# EasyEDA Pro project AD637峰值_运放峰值_AGC_AD8367_万能运放.eprj, schematic Schematic1

## Sheets
1 P1: Board Name: Board1; Create Date: 2025-02-21; Page Name: P1; Project Name: AD637峰值_运放峰值_AGC_AD8367_万能运放; Schematic Name: Schematic1; Update Date: 2025-06-21; Company: 嘉立创EDA; Page Size: A4; Version: V1.0
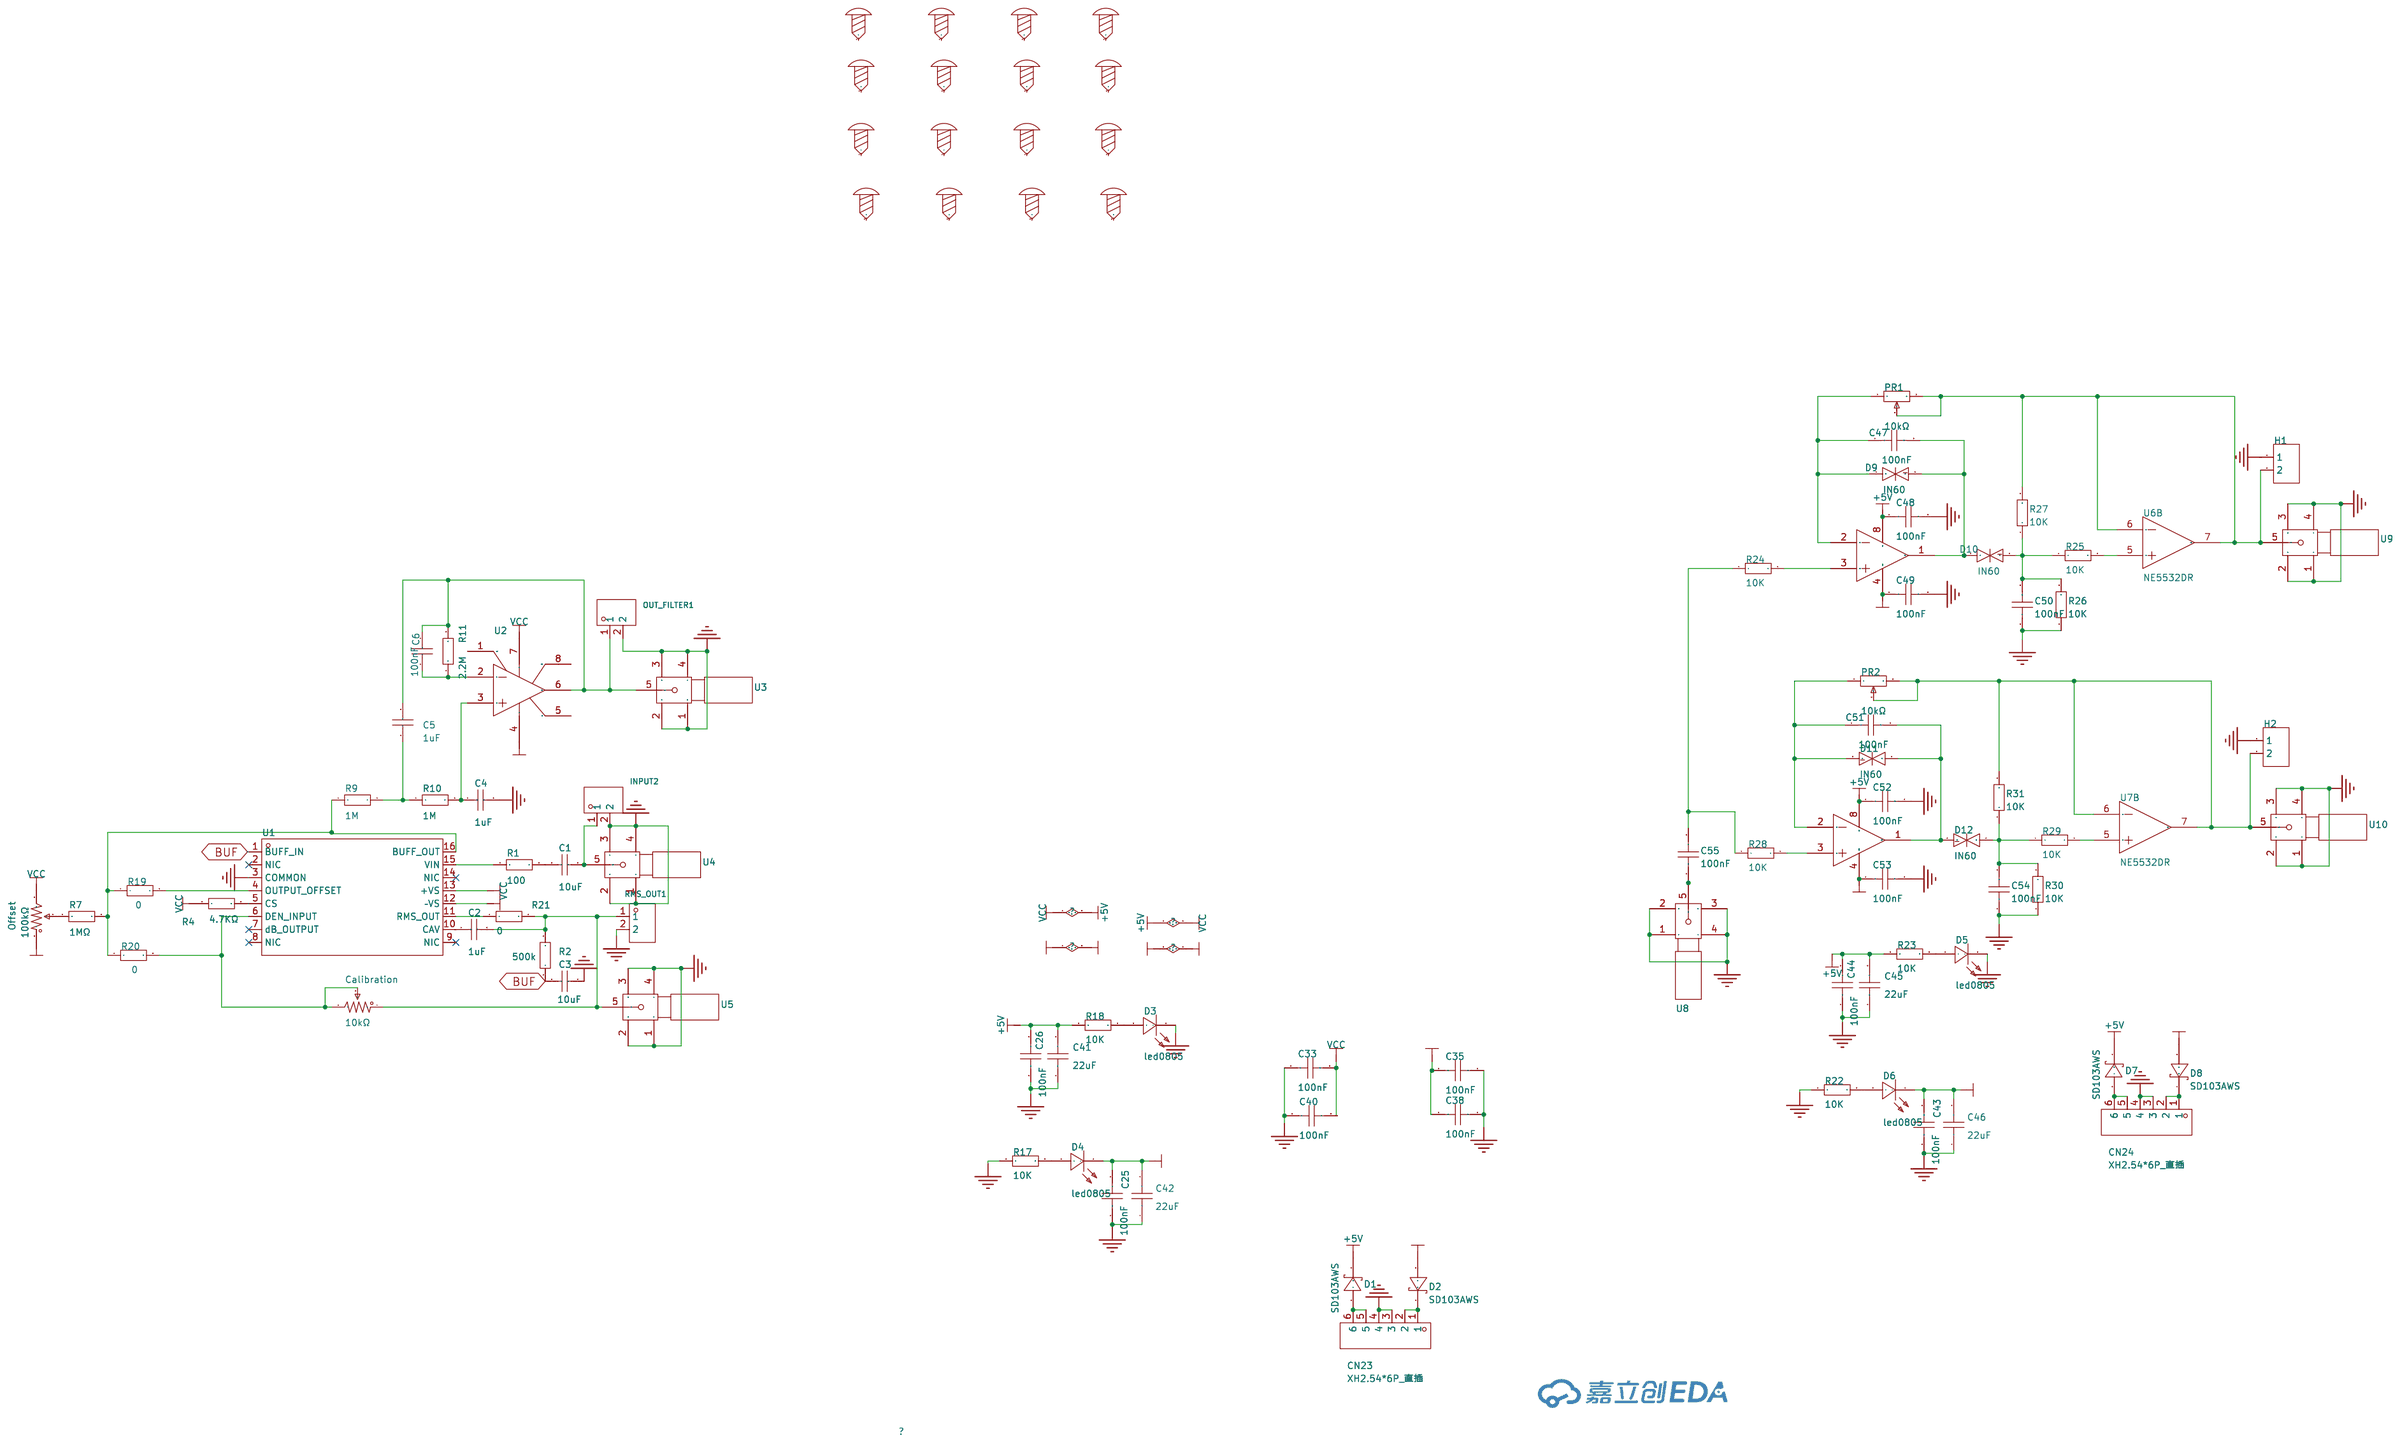
[diagram p0: P1]
2 P2: Create Date: 2025-04-23; Page Name: P2; Update Date: 2025-04-23
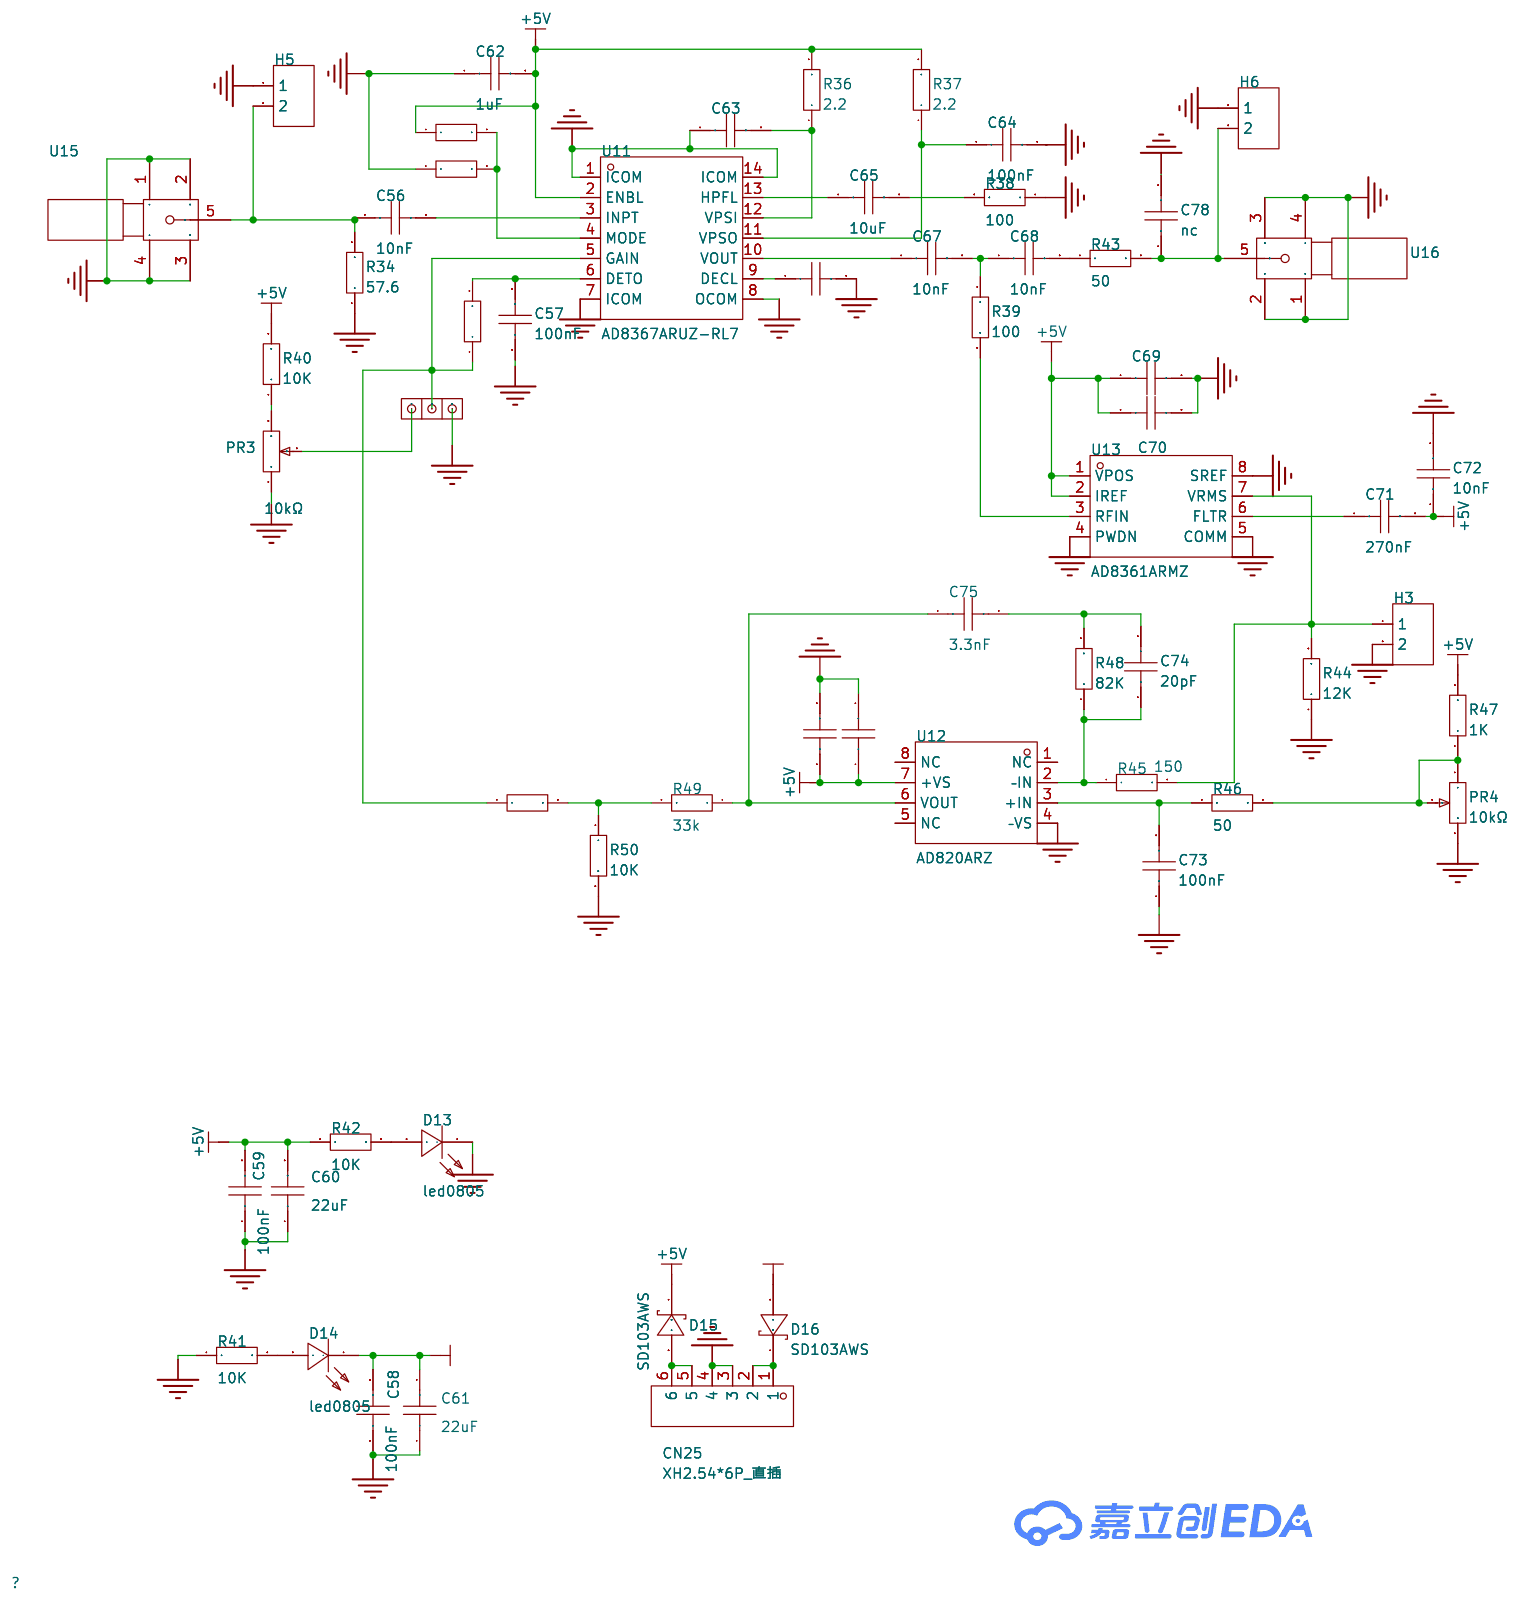
[diagram p1: P2]
3 P3: Create Date: 2025-04-23; Page Name: P3; Update Date: 2025-04-24
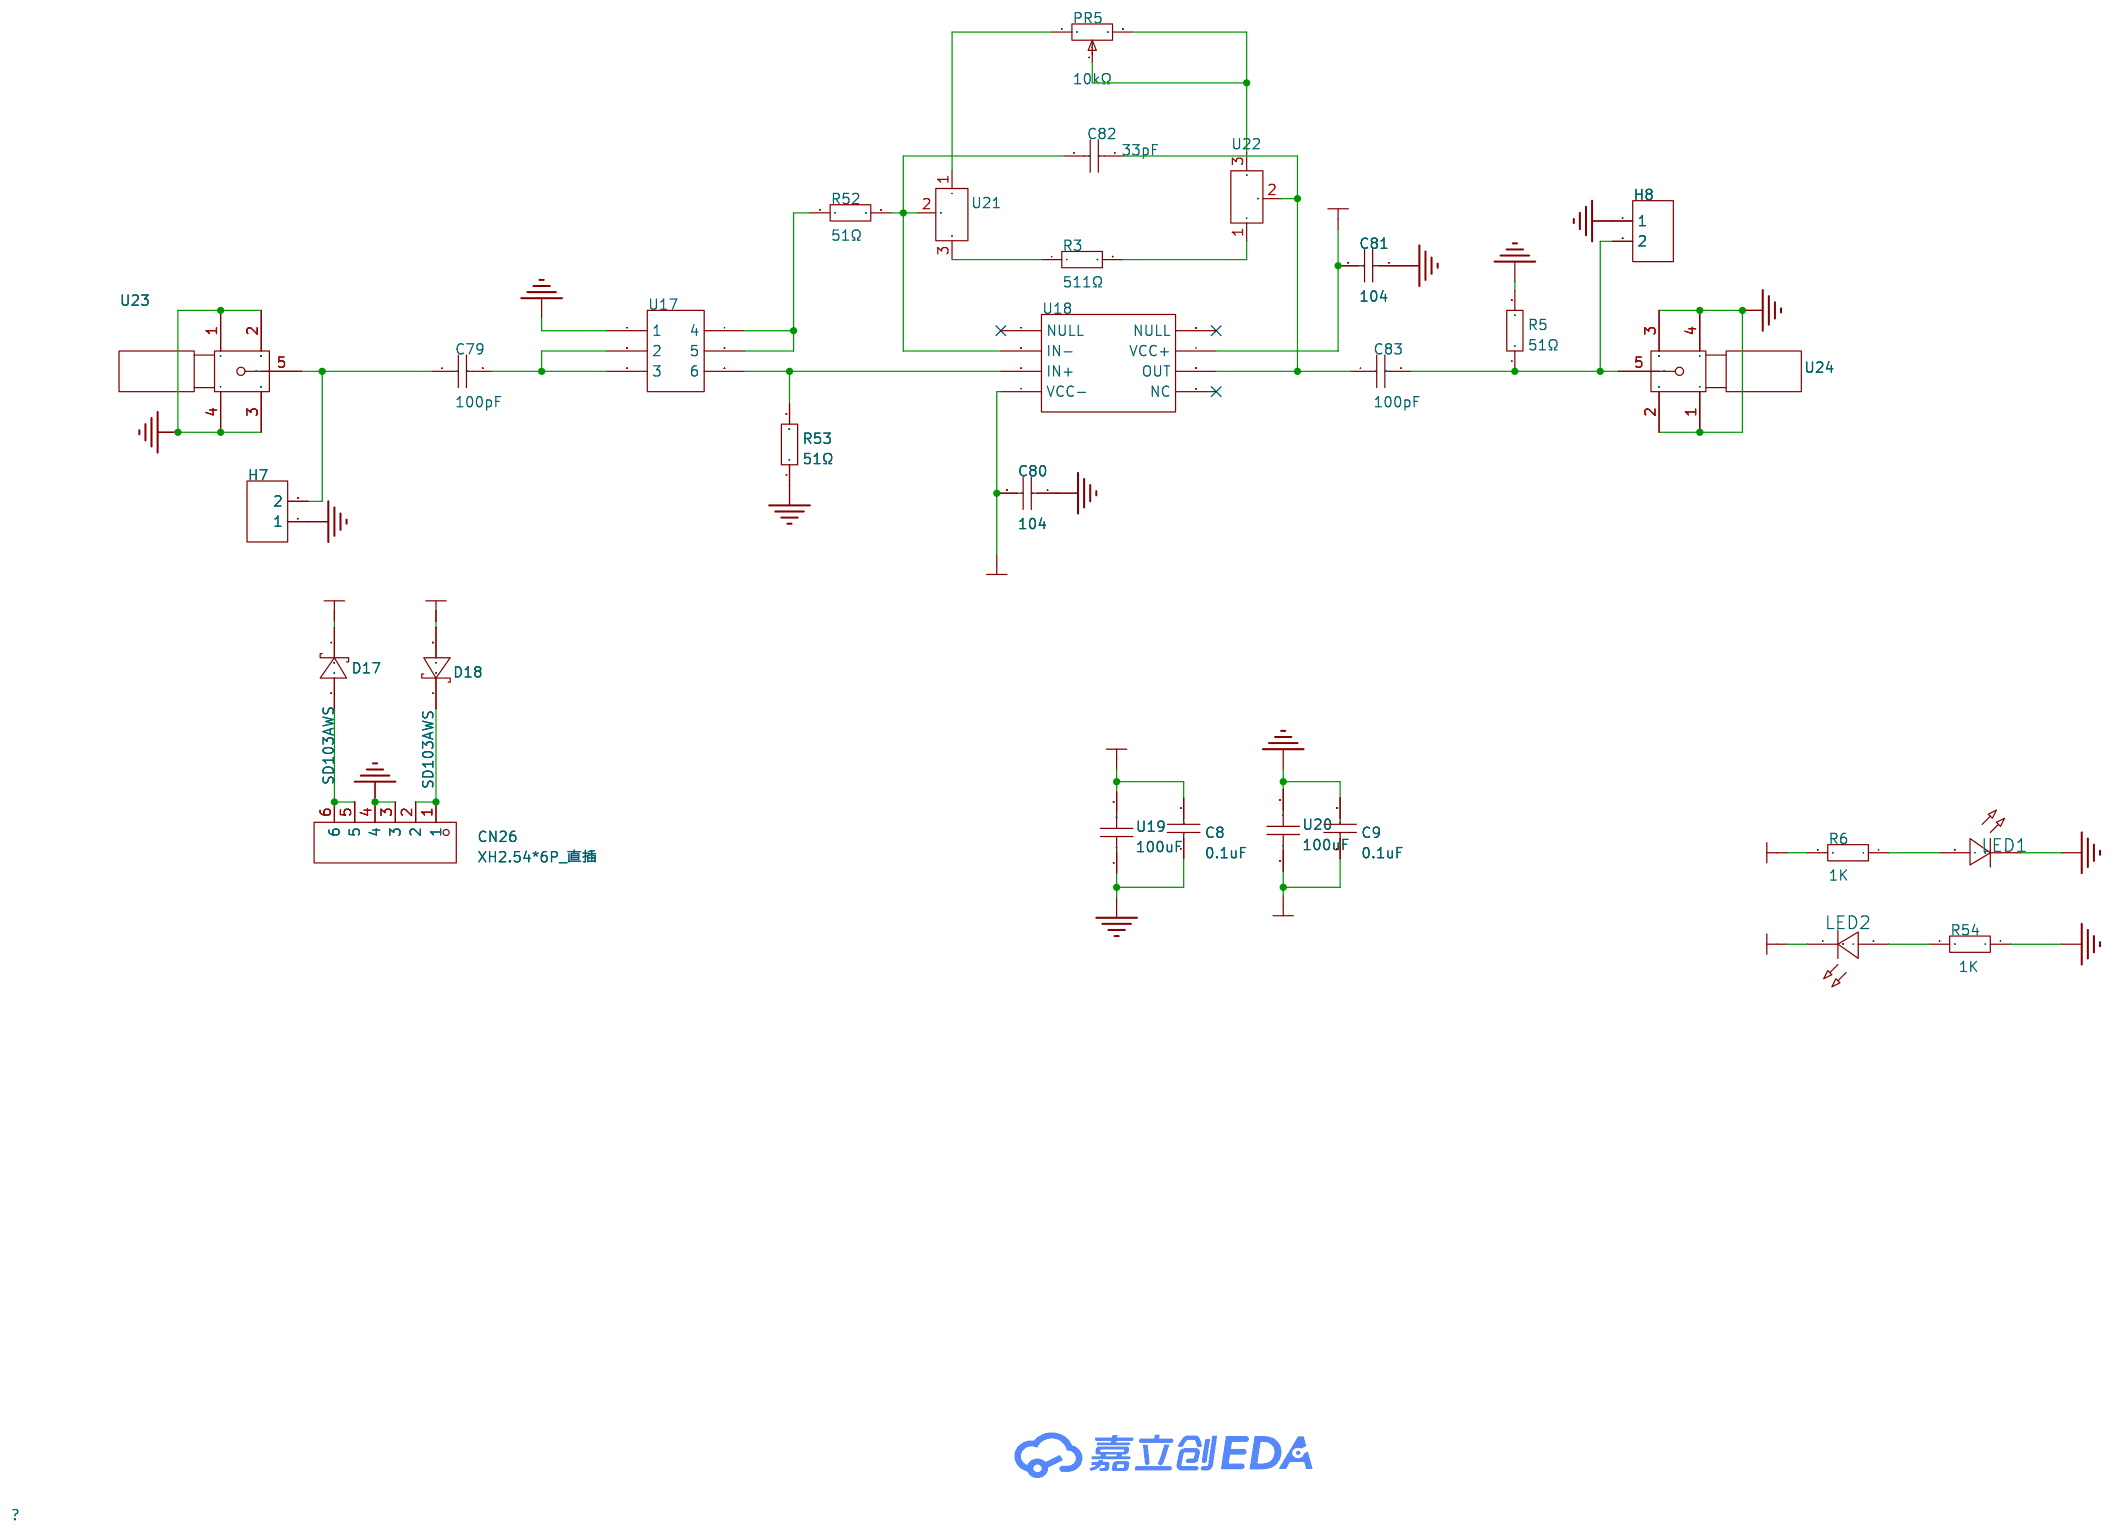
[diagram p2: P3]

## Parts
sheet P1
C1  10uF  [R0805]
C2  1uF  [R0805]
C3  10uF  [R0805]
C4  1uF  [R0805]
C5  1uF  [R0805]
C6  100nF  [R0805]
C25  100nF  [R0805]
C26  100nF  [R0805]
C33  100nF  [R0805]
C35  100nF  [R0805]
C38  100nF  [R0805]
C40  100nF  [R0805]
C41  22uF  [C1210]
C42  22uF  [C1210]
C43  100nF  [R0805]
C44  100nF  [R0805]
C45  22uF  [C1210]
C46  22uF  [C1210]
C47  100nF  [R0805]
C48  100nF  [R0805]
C49  100nF  [R0805]
C50  100nF  [R0805]
C51  100nF  [R0805]
C52  100nF  [R0805]
C53  100nF  [R0805]
C54  100nF  [R0805]
C55  100nF  [R0805]
Calibration  10kΩ  [RES-ADJ-TH_3P-L10.0-W10.0-P2.50-L]
CN23  XH2.54*6P_直插  [CONN-TH_XH2.54-6P]
CN24  XH2.54*6P_直插  [CONN-TH_XH2.54-6P]
D1  SD103AWS  [SOD-323_L1.8-W1.3-LS2.5-RD]
D2  SD103AWS  [SOD-323_L1.8-W1.3-LS2.5-RD]
D3  led0805  [LED0805-RD]
D4  led0805  [LED0805-RD]
D5  led0805  [LED0805-RD]
D6  led0805  [LED0805-RD]
D7  SD103AWS  [SOD-323_L1.8-W1.3-LS2.5-RD]
D8  SD103AWS  [SOD-323_L1.8-W1.3-LS2.5-RD]
D9  IN60  [LL-34_L3.5-W1.5-BI]
D10  IN60  [LL-34_L3.5-W1.5-BI]
D11  IN60  [LL-34_L3.5-W1.5-BI]
D12  IN60  [LL-34_L3.5-W1.5-BI]
H1  -  [HDR-TH_2P-P2.54-V-F]
H2  -  [HDR-TH_2P-P2.54-V-F]
INPUT2  PZ254V-11-02P  [HDR-TH_2P-P2.54-V-M]
Offset  100kΩ  [RES-ADJ-TH_3P-L10.0-W10.0-P2.50-L]
OUT_FILTER1  PZ254V-11-02P  [HDR-TH_2P-P2.54-V-M]
PR1  10kΩ  [R_3296]
PR2  10kΩ  [R_3296]
R1  100  [R0805]
R2  500k  [R0805]
R4  4.7KΩ  [R0805]
R7  1MΩ  [R0805]
R9  1M  [R0805]
R10  1M  [R0805]
R11  2.2M  [R0805]
R17  10K  [R0805]
R18  10K  [R0805]
R19  0  [R0805]
R20  0  [R0805]
R21  0  [R0805]
R22  10K  [R0805]
R23  10K  [R0805]
R24  10K  [R0805]
R25  10K  [R0805]
R26  10K  [R0805]
R27  10K  [R0805]
R28  10K  [R0805]
R29  10K  [R0805]
R30  10K  [R0805]
R31  10K  [R0805]
RMS_OUT1  PZ254V-11-02P  [HDR-TH_2P-P2.54-V-M]
SCREW1  -  [M3螺丝]
SCREW2  -  [M3螺丝]
SCREW3  -  [M3螺丝]
SCREW4  -  [M3螺丝]
SCREW5  -  [M3螺丝]
SCREW6  -  [M3螺丝]
SCREW7  -  [M3螺丝]
SCREW8  -  [M3螺丝]
SCREW9  -  [M3螺丝]
SCREW10  -  [M3螺丝]
SCREW11  -  [M3螺丝]
SCREW12  -  [M3螺丝]
SCREW13  -  [M3螺丝]
SCREW14  -  [M3螺丝]
SCREW15  -  [M3螺丝]
SCREW16  -  [M3螺丝]
U1  AD637ARZ  [SOIC-16_L10.3-W7.5-P1.27-LS10.3-BL]
U2  OP07  [SOP-8_L4.9-W3.9-P1.27-LS6.0-BL]
U3  -  [SMA]
U4  -  [SMA]
U5  -  [SMA]
U6  NE5532DR  [SOIC-8_L4.9-W3.9-P1.27-LS6.0-BL]  (sections 1,2)
U7  NE5532DR  [SOIC-8_L4.9-W3.9-P1.27-LS6.0-BL]  (sections 1,2)
U8  -  [SMA]
U9  -  [SMA]
U10  -  [SMA]
sheet P2
C56  10nF  [R0805]
C57  100nF  [R0805]
C58  100nF  [R0805]
C59  100nF  [R0805]
C60  22uF  [C1210]
C61  22uF  [C1210]
C62  1uF  [R0805]
C63  100nF  [R0805]
C64  100nF  [R0805]
C65  10uF  [R0805]
C66  10uF  [R0805]
C67  10nF  [R0805]
C68  10nF  [R0805]
C69  100nF  [R0805]
C70  10nF  [R0805]
C71  270nF  [R0805]
C72  10nF  [R0805]
C73  100nF  [R0805]
C74  20pF  [R0805]
C75  3.3nF  [R0805]
C76  100nF  [R0805]
C77  10nF  [R0805]
C78  nc  [R0805]
CN25  XH2.54*6P_直插  [CONN-TH_XH2.54-6P]
D13  led0805  [LED0805-RD]
D14  led0805  [LED0805-RD]
D15  SD103AWS  [SOD-323_L1.8-W1.3-LS2.5-RD]
D16  SD103AWS  [SOD-323_L1.8-W1.3-LS2.5-RD]
H3  -  [HDR-TH_2P-P2.54-V-F]
H5  -  [HDR-TH_2P-P2.54-V-F]
H6  -  [HDR-TH_2P-P2.54-V-F]
PR3  10kΩ  [R_3296]
PR4  10kΩ  [R_3296]
R32  10K  [R0805]
R33  10K  [R0805]
R34  57.6  [R0805]
R35  10K  [R0805]
R36  2.2  [R0805]
R37  2.2  [R0805]
R38  100  [R0805]
R39  100  [R0805]
R40  10K  [R0805]
R41  10K  [R0805]
R42  10K  [R0805]
R43  50  [R0805]
R44  12K  [R0805]
R45  150  [R0805]
R46  50  [R0805]
R47  1K  [R0805]
R48  82K  [R0805]
R49  33k  [R0805]
R50  10K  [R0805]
R51  10K  [R0805]
U11  AD8367ARUZ-RL7  [TSSOP-14_L5.0-W4.4-P0.65-LS6.4-BL]
U12  AD820ARZ  [SOIC-8_L4.9-W3.9-P1.27-LS6.0-BL]
U13  AD8361ARMZ  [MSOP-8_L3.0-W3.0-P0.65-LS4.9-BL]
U14  -  [1*3跳线]
U15  -  [SMA]
U16  -  [SMA]
sheet P3
C8  0.1uF  [R0805]
C9  0.1uF  [R0805]
C79  100pF  [R0805]
C80  104  [R0805]
C81  104  [R0805]
C82  33pF  [R0805]
C83  100pF  [R0805]
CN26  XH2.54*6P_直插  [CONN-TH_XH2.54-6P]
D17  SD103AWS  [SOD-323_L1.8-W1.3-LS2.5-RD]
D18  SD103AWS  [SOD-323_L1.8-W1.3-LS2.5-RD]
H7  -  [HDR-TH_2P-P2.54-V-F]
H8  -  [HDR-TH_2P-P2.54-V-F]
LED1  -  [LED_0805]
LED2  -  [LED_0805]
PR5  10kΩ  [R_3296]
R3  511Ω  [R0805]
R5  51Ω  [R0805]
R6  1K  [R0805]
R52  51Ω  [R0805]
R53  51Ω  [R0805]
R54  1K  [R0805]
U17  -  [3*3连跳线帽]
U18  -  [THS4001CD]
U19  100uF  [C1210]
U20  100uF  [C1210]
U21  -  [1*3选择跳线帽]
U22  -  [1*3选择跳线帽]
U23  -  [SMA]
U24  -  [SMA]

## Library data of the parts
C1-C6 = CC0805KRX7R9BB104: 容值:100nF;精度:±10%;额定电压:50V;材质(温度系数):X7R;; LCSC Part Name: 100nF ±10% 50V; Supplier Part: C49678; Manufacturer: YAGEO(国巨); Supplier Footprint: 0805; JLCPCB Part Class: Basic Part; Datasheet: https://atta.szlcsc.com/upload/public/pdf/source/20151026/1457707504898.pdf; Supplier: LCSC; Tolerance: ±10%; Voltage Rated: 50V; Temperature Coefficient: X7R
C25 C26 C33 C35 C38 C40 C43 C44 C47-C59 C62-C78 = CAP_0805: Supplier Footprint: 0805
C41 C42 C45 C46 C60 C61 = CL32B226KAJNNNE: 容值:22uF;精度:±10%;额定电压:25V;材质(温度系数):X7R;; LCSC Part Name: 22uF ±10% 25V; Supplier Part: C309062; Manufacturer: SAMSUNG(三星); Supplier Footprint: 1210; JLCPCB Part Class: 扩展库; Datasheet: https://atta.szlcsc.com/upload/public/pdf/source/20160218/1457707763339.pdf; Supplier: LCSC; Tolerance: ±10%; Voltage Rated: 25V; Temperature Coefficient: X7R
Calibration Offset = 3296W-1-103: 阻值:10kΩ;精度:±10%;; LCSC Part Name: 10kΩ ±10%; Supplier Part: C118954; Manufacturer: BOCHEN(博晨); Supplier Footprint: 插件; JLCPCB Part Class: Extended Part; Datasheet: https://atta.szlcsc.com/upload/public/pdf/source/20171114/C118954_15106326646611117443.pdf; Supplier: LCSC; Tolerance: ±10%
CN23-CN26 = XH2.54*6P_直插: Supplier Part: C9900008614; Supplier Footprint: XH2.54_6P; JLCPCB Part Class: 扩展库; Supplier: LCSC
D1 D2 D7 D8 D15-D18 = SD103AWS_C181207: 正向压降(Vf):600mV@200mA;直流反向耐压(Vr):40V;整流电流:350mA;; LCSC Part Name: 电压:40V 电流:350mA 丝印S4; Supplier Part: C181207; Manufacturer: Hottech(合科泰); Supplier Footprint: SOD-323; JLCPCB Part Class: 扩展库; Datasheet: https://atta.szlcsc.com/upload/public/pdf/source/20240513/4691873FBB9173EFBCF4C6FD4BBA1025.pdf; Supplier: LCSC; Forward Voltage (Vf@If): 600mV@200mA; Reverse Voltage (Vr): 40V; Rectified Current: 350mA
D3-D6 D13 D14 = led0805: Supplier Part: C9900012722; JLCPCB Part Class: 扩展库; Supplier: LCSC
D9-D12 = LLDB3_C5359964: LCSC Part Name: LLDB3; Supplier Part: C5359964; Manufacturer: MSKSEMI(美森科); Supplier Footprint: LL-34; JLCPCB Part Class: Extended Part; Datasheet: https://atta.szlcsc.com/upload/public/pdf/source/20231010/30BB713440970011FFB42069FEAB5216.pdf; Supplier: LCSC; Breakover Current (Ibo): 50uA; Repetitive Peak On-state Current (Itrm): 2A; Vbo (Range Value): 28V~36V; Rise Time (tr): 2us; Operating Temperature: -40℃~+125℃
H1-H3 H5-H8 = HDR-F_2.54_1x2P: Supplier Part: C49661; Supplier Footprint: 插件
INPUT2 OUT_FILTER1 RMS_OUT1 = PZ254V-11-02P: 排数:单排;总PIN位数:2P;间距:2.54mm;插针结构:1x2P;行距:-;安装类型:直插;圆针/方针:方针;额定电流:-;额定电压:-;配合针长度:6mm;塑高:2.5mm;端接针长度:3mm;触头材质:黄铜;触头镀层:-;工作温度范围:-40~+105;颜色:黑色;; LCSC Part Name: 2.54mm 1x2P 直插 方针; Supplier Part: C492401; Manufacturer: XFCN(兴飞); Supplier Footprint: 插件,P=2.54mm; JLCPCB Part Class: Extended Part; Datasheet: https://atta.szlcsc.com/upload/public/pdf/source/20200309/C492401_A812433581A9B211A7FFA413ADDFF0E5.pdf; Supplier: LCSC; Number of Rows: 单排; Number of Pins: 2P; Pitch: 2.54mm; Pin Structure: 1x2P; Mounting Type: 直插; Circluar Pins/Square Pins: 方针; Length of Mating Pin: 6mm; Insulation Height: 2.5mm; Length of End Connection Pin: 3mm; Contact Material: 黄铜; Operating Temperature Range: -40~+105; Color: 黑色
PR1-PR5 = R_3296: Supplier Footprint: 直插
R1 R2 R4 R7 R9-R11 = 0805W8F1002T5E_C17414: 电阻类型:厚膜电阻;阻值:10kΩ;精度:±1%;功率:125mW;; LCSC Part Name: 10kΩ ±1% 125mW; Supplier Part: C17414; Manufacturer: UNI-ROYAL(厚声); Manufacturer Part: 0805W8F1002T5E; Supplier Footprint: 0805; JLCPCB Part Class: Basic Part; Datasheet: https://atta.szlcsc.com/upload/public/pdf/source/20200306/C422600_1E6D84923E4A46A82E41ADD87F860B5C.pdf; Supplier: LCSC; Type: 厚膜电阻; Tolerance: ±1%; Power(Watts): 125mW; Temperature Coefficient: ±100ppm/; Overload Voltage (Max): 150V; Operating Temperature Range: -55~+155
R17-R51 = Res_0805: Supplier Footprint: 0805
SCREW1-SCREW16 = M3螺丝: Supplier Footprint: 插件
U1 = AD637ARZ: Supplier Part: C392907; Manufacturer: ADI(亚德诺)/LINEAR(凌特); Supplier Footprint: SOIC-16-300mil; JLCPCB Part Class: Extended Part; Datasheet: https://atta.szlcsc.com/upload/public/pdf/source/20190605/C392907_F1D13CB629A7AFD79CF3323A59E1C27B.pdf; Supplier: LCSC
U2 = OP07: 放大器组数:-;; Supplier Part: C1508997; Manufacturer: 杭州瑞盟; Supplier Footprint: SOP-8; JLCPCB Part Class: Extended Part; Datasheet: https://atta.szlcsc.com/upload/public/pdf/source/20201221/C1508997_31DB1D3DFE7BEFB064DC1C62AA82E0AA.pdf; Supplier: LCSC
U3-U5 U8-U10 U15 U16 U23 U24 = SMA
U6 U7 = NE5532DR: Supplier Part: C7426; Manufacturer: TI(德州仪器); Supplier Footprint: SOIC-8; JLCPCB Part Class: 基础库; Datasheet: http://www.ti.com/cn/lit/gpn/ne5532; Supplier: LCSC; Number of Circuits: 双路; Gain Bandwidth Product(GBP): 10MHz; Current - Input Bias(Ib): 200nA; Slew Rate(SR): 9V/us; Output Current: 38mA; Supply Current: 8mA; Operating Temperature: 0℃~+70℃
U11 = AD8367ARUZ-RL7: LCSC Part Name: 500 MHz，线性dB可变增益放大器（VGA）带自动增能控制（AGC）检测器; Supplier Part: C191561; Manufacturer: ADI(亚德诺); Supplier Footprint: TSSOP-14; JLCPCB Part Class: 扩展库; Datasheet: https://atta.szlcsc.com/upload/public/pdf/source/20200408/C191561_25904AF254F64640D2A0ECFC6C3DB0D9.pdf; Supplier: LCSC; Supply Voltage: 2.7V~5.5V; Operating Temperature: -40℃~+85℃
U12 = AD820ARZ: Supplier Part: C578639; Manufacturer: ADI(亚德诺); Supplier Footprint: SOIC-8; JLCPCB Part Class: 扩展库; Datasheet: https://atta.szlcsc.com/upload/public/pdf/source/20180416/C207529_68488E04296095E231AC16C2E26C84C0.pdf; Supplier: LCSC; Gain Bandwidth Product(GBP): 1.8MHz; Current - Input Bias(Ib): 2pA; Voltage - Input Offset(Vos): 400uV; Slew Rate(SR): 3V/us; Operating Temperature: -40℃~+85℃
U13 = AD8361ARMZ: LCSC Part Name: RMS 功率检测器; Supplier Part: C578709; Manufacturer: ADI(亚德诺); Supplier Footprint: MSOP-8; JLCPCB Part Class: 扩展库; Datasheet: https://atta.szlcsc.com/upload/public/pdf/source/20200408/C130107_5C4C2FB002E66DB882E0E5EE2445969B.pdf; Supplier: LCSC; Applications: 手机；W-CDMA；CDMA; Frequency Range: 0MHz~2.5GHz; Input Range: -21dBm~5dBm; Supply Voltage: 2.7V~5.5V; Supply Current: 1.1mA; Accuracy: ±0.25dB; Operating Temperature: -40℃~+85℃
U14 = 1*3跳线
C8 C9 C79-C83 = CL21C101JBANNNC: 容值:100pF;精度:±5%;额定电压:50V;材质(温度系数):C0G;; LCSC Part Name: 100pF ±5% 50V; Supplier Part: C1790; Manufacturer: SAMSUNG(三星); Supplier Footprint: 0805; JLCPCB Part Class: 基础库; Datasheet: https://atta.szlcsc.com/upload/public/pdf/source/20160218/1457707763339.pdf; Supplier: LCSC; Tolerance: ±5%; Voltage Rated: 50V; Temperature Coefficient: C0G
LED1 LED2 = LED_0805-R: Supplier Footprint: 0805
R3 = 0805W8F5110T5E: 电阻类型:厚膜电阻;阻值:511Ω;精度:±1%;功率:125mW;最大工作电压:150V;温度系数:±100ppm/℃;; LCSC Part Name: 511Ω ±1% 125mW 厚膜电阻; Supplier Part: C17736; Manufacturer: UNI-ROYAL(厚声); Supplier Footprint: 0805; JLCPCB Part Class: 扩展库; Datasheet: https://atta.szlcsc.com/upload/public/pdf/source/20200306/C422600_1E6D84923E4A46A82E41ADD87F860B5C.pdf; Supplier: LCSC; Type: 厚膜电阻; Tolerance: ±1%; Power(Watts): 125mW; Overload Voltage (Max): 150V; Temperature Coefficient: ±100ppm/℃; Operating Temperature Range: -55℃~+155℃
R5 R6 R52-R54 = 0805W8F510JT5E: 电阻类型:厚膜电阻;阻值:51Ω;精度:±1%;功率:125mW;最大工作电压:150V;温度系数:±100ppm/℃;; LCSC Part Name: 51Ω ±1% 125mW 厚膜电阻; Supplier Part: C17738; Manufacturer: UNI-ROYAL(厚声); Supplier Footprint: 0805; JLCPCB Part Class: 基础库; Datasheet: https://atta.szlcsc.com/upload/public/pdf/source/20200306/C422600_1E6D84923E4A46A82E41ADD87F860B5C.pdf; Supplier: LCSC; Type: 厚膜电阻; Tolerance: ±1%; Power(Watts): 125mW; Overload Voltage (Max): 150V; Temperature Coefficient: ±100ppm/℃; Operating Temperature Range: -55℃~+155℃
U17 = 3*3连跳线帽
U18 = THS4001CD
U19 U20 = HGC1210R5107M160NSVK: 容值:100uF;精度:±20%;额定电压:16V;材质(温度系数):X5R;; LCSC Part Name: 100uF ±20% 16V; Supplier Part: C7432790; Manufacturer: Chinocera(华瓷); Supplier Footprint: 1210; JLCPCB Part Class: 扩展库; Datasheet: https://atta.szlcsc.com/upload/public/pdf/source/20240320/FAC3FEC40A78BC5CCCE96C232A94D860.pdf; Supplier: LCSC; Tolerance: ±20%; Voltage Rated: 16V; Temperature Coefficient: X5R
U21 U22 = 1*3PIN-选择跳线帽

## Nets
+5V: C26.2 C33.2 C40.2 C41.2 C44.2 C45.2 C48.1 C52.1 C59.2 C60.2 C62.2 C69.1 C70.1 C71.2 C72.1 C76.1 C77.1 D1.1(C) D7.1(C) D15.1(C) Offset.3 R4.1 R18.1 R23.1 R32.1 R36.2 R37.2 R40.2 R42.1 R47.2 U1.13(+VS) U2.7(V+) U6.8(VCC+) U7.8(VCC+) U11.2(ENBL) U12.7(+VS) U13.1(VPOS) U13.2(IREF)
-5V: C9.1 C25.2 C35.1 C38.1 C42.2 C43.2 C46.2 C49.1 C53.1 C58.2 C61.2 C80.2 D2.2(A) D4.1(-) D6.1(-) D8.2(A) D14.1(-) D16.2(A) D18.2(A) LED2.1(C) Offset.1 U1.12(–VS) U2.4(V-) U6.4(VCC-/GND) U7.4(VCC-/GND) U18.4(VCC-) U20.1
GND: C3.2 C4.2 C8.1 C9.2 C25.1 C26.1 C33.1 C35.2 C38.2 C40.1 C41.1 C42.1 C43.1 C44.1 C45.1 C46.1 C48.2 C49.2 C50.1 C52.2 C53.2 C54.1 C57.1 C58.1 C59.1 C60.1 C61.1 C62.1 C63.1 C64.2 C66.2 C69.2 C70.2 C72.2 C73.1 C76.2 C77.2 C78.2 C80.1 C81.1 CN23.3 CN23.4 CN24.3 CN24.4 CN25.3 CN25.4 CN26.3 CN26.4 D3.1(-) D5.1(-) D13.1(-) H1.1 H2.1 H3.2 H5.1 H6.1 H7.1 H8.1 INPUT2.2 LED1.1(C) OUT_FILTER1.2 PR3.1 PR4.3 R5.2 R17.1 R22.1 R26.1 R30.1 R33.1 R34.1 R38.1 R41.1 R44.1 R50.2 R53.1 R54.1 RMS_OUT1.2 U1.3(COMMON) U3.1 U3.2 U3.3 U3.4 U4.1 U4.2 U4.3 U4.4 U5.1 U5.2 U5.3 U5.4 U8.1 U8.2 U8.3 U8.4 U9.1 U9.2 U9.3 U9.4 U10.1 U10.2 U10.3 U10.4 U11.1(ICOM) U11.7(ICOM) U11.8(OCOM) U11.14(ICOM) U12.4(–VS) U13.4(PWDN) U13.5(COMM) U13.8(SREF) U14.3 U15.1 U15.2 U15.3 U15.4 U16.1 U16.2 U16.3 U16.4 U17.1 U19.1 U20.2 U23.1 U23.2 U23.3 U23.4 U24.1 U24.2 U24.3 U24.4
VDD: C8.2 C81.2 D17.1(C) R6.2 U18.7(VCC+) U19.2
BUF: C3.1 R2.1 U1.1(BUFF IN)
$1N3231: C2.2 Calibration.1 R2.2 R21.2 RMS_OUT1.1 U5.5
$1N3235: Calibration.2 Calibration.3 R20.2 U1.6(DEN INPUT)
$1N3238: R19.2 U1.4(OUTPUT OFFSET)
$1N3239: R4.2 U1.5(CS)
$1N3240: R7.2 R9.1 R19.1 R20.1 U1.16(BUFF OUT)
$1N3243: Offset.2 R7.1
$1N3247: C1.2 INPUT2.1 U4.5
$1N3248: C1.1 R1.2
$1N3250: C5.1 R9.2 R10.1
$1N3252: C2.1 U1.10(CAV)
$1N3253: R1.1 U1.15(VIN)
$1N3256: C5.2 C6.2 OUT_FILTER1.1 R11.2 U2.6(OUT) U3.5
$1N3259: C4.1 R10.2 U2.3(IN+)
$1N3260: C6.1 R11.1 U2.2(IN-)
$1N3765: CN23.5 CN23.6 D1.2(A)
$1N3767: CN23.1 CN23.2 D2.1(C)
$1N5708: R21.1 U1.11(RMS OUT)
$1N8199: D4.2(+) R17.2
$1N9251: D3.2(+) R18.2
$1N10609: D6.2(+) R22.2
$1N10610: D5.2(+) R23.2
$1N10759: CN24.1 CN24.2 D8.1(C)
$1N10760: CN24.5 CN24.6 D7.2(A)
$1N11302: R24.2 U6.3(IN1+)
$1N11315: C47.1 D9.1(M1) PR1.1 U6.2(IN1-)
$1N11336: C47.2 D9.2(M2) D10.1(M1) U6.1(OUT1)
$1N11392: C50.2 D10.2(M2) R25.1 R26.2 R27.1
$1N11419: R25.2 U6.5(IN2+)
$1N11452: H1.2 PR1.2 PR1.3 R27.2 U6.6(IN2-) U6.7(OUT2) U9.5
$1N12053: H2.2 PR2.2 PR2.3 R31.2 U7.6(IN2-) U7.7(OUT2) U10.5
$1N12065: R29.2 U7.5(IN2+)
$1N12071: C54.2 D12.1(M1) R29.1 R30.2 R31.1
$1N12077: R28.2 U7.3(IN1+)
$1N12079: C51.1 D11.2(M2) PR2.1 U7.2(IN1-)
$1N12087: C51.2 D11.1(M1) D12.2(M2) U7.1(OUT1)
$1N12290: C55.1 U8.5
$1N12318: C55.2 R24.1 R28.1
$2N637: R32.2 R33.2 U11.4(MODE)
$2N706: C56.1 H5.2 R34.2 U15.5
$2N759: C56.2 U11.3(INPT)
$2N792: C57.2 R35.2 U11.6(DETO)
$2N878: R35.1 R51.1 U11.5(GAIN) U14.2
$2N1047: PR3.3 R40.1
$2N1082: PR3.2 U14.1
$2N1528: D13.2(+) R42.2
$2N1532: D14.2(+) R41.2
$2N1537: CN25.1 CN25.2 D16.1(C)
$2N1538: CN25.5 CN25.6 D15.2(A)
$2N1711: C63.2 R36.1 U11.12(VPSI)
$2N1732: C64.1 R37.1 U11.11(VPSO)
$2N1871: C65.1 U11.13(HPFL)
$2N1875: C65.2 R38.2
$2N1987: C66.1 U11.9(DECL)
$2N2092: C67.1 U11.10(VOUT)
$2N2096: C67.2 C68.1 R39.1
$2N2126: C68.2 R43.1
$2N2286: C78.1 H6.2 R43.2 U16.5
$2N2300: R39.2 U13.3(RFIN)
$2N2867: C71.1 U13.6(FLTR)
$2N2919: H3.1 R44.2 R45.2 U13.7(VRMS)
$2N3066: C74.1 R45.1 R48.1 U12.2(–IN)
$2N3072: C73.2 R46.1 U12.3(+IN)
$2N3100: PR4.1 PR4.2 R46.2 R47.1
$2N3468: C74.2 C75.2 R48.2
$2N3483: C75.1 R49.1 U12.6(VOUT)
$2N3598: R49.2 R50.1 R51.2
$3N1223: C82.2 C83.1 U18.6(OUT) U22.2
$3N1226: LED2.2(A) R54.2
$3N1228: LED1.2(A) R6.1
$3N1231: C83.2 H8.2 R5.1 U24.5
$3N1234: R3.2 U22.1
$3N1235: PR5.2 PR5.3 U22.3
$3N1239: R3.1 U21.3
$3N1240: PR5.1 U21.1
$3N1241: R52.1 U17.4 U17.5
$3N1242: R53.2 U17.6 U18.3(IN+)
$3N1244: C82.1 R52.2 U18.2(IN-) U21.2
$3N1248: CN26.1 CN26.2 D18.1(C)
$3N1250: CN26.5 CN26.6 D17.2(A)
$3N1253: C79.2 U17.2 U17.3
$3N1254: C79.1 H7.2 U23.5

Not connected (* = marked no-connect by the designer): SCREW1 1; SCREW2 1; SCREW3 1; SCREW4 1; SCREW5 1; SCREW6 1; SCREW7 1; SCREW8 1; SCREW9 1; SCREW10 1; SCREW11 1; SCREW12 1; SCREW13 1; SCREW14 1; SCREW15 1; SCREW16 1; U1 2(NIC)* 7(dB OUTPUT)* 8(NIC)* 9(NIC)* 14(NIC)*; U2 1(VOS TRIM) 5(NC) 8(VOS TRIM); U12 1(NC) 5(NC) 8(NC); U18 1(NULL)* 5(NC)* 8(NULL)*
